# Altium schematic sheet BNC IO.SchDoc
size 297 x 209 mm; CompanyName: Sainsbury Wellcome Centre; Organization: FabLab; Address1: Sainsbury Wellcome Centre; Address2: 25 Howland Street; Address3: London; Address4: W1T 4JG; DocumentNumber: 6; SheetNumber: 2; SheetTotal: 5; swcgroup: FabLab; Org: Sainsbury Wellcome Centre; Add1: 25 Howland Street; Add2: London; Add3: W1T 4JG; WebAddress: www.sainsburywellcome.org; SheetSize: A4; SheetName: BNC IO
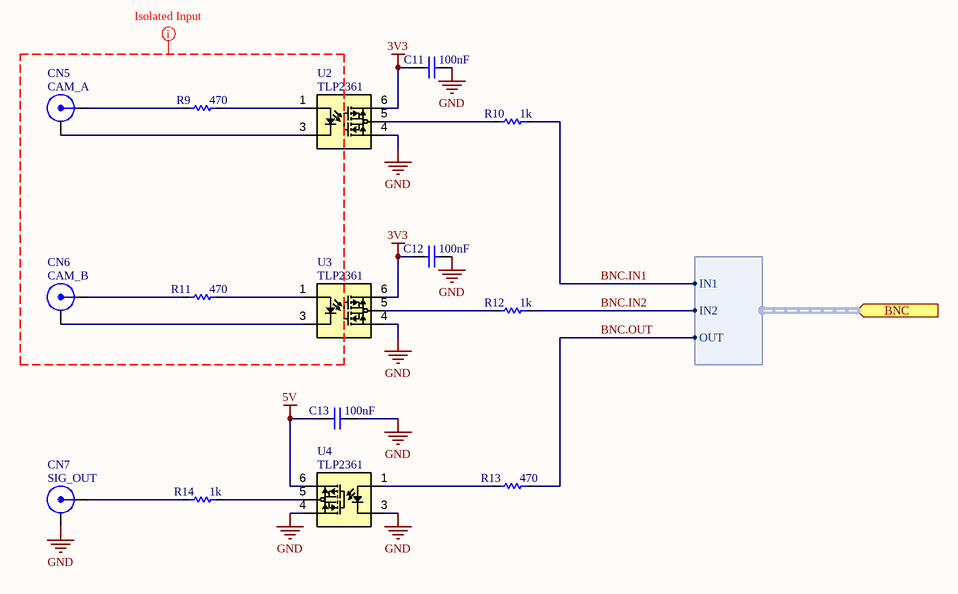
[diagram p0: BNC IO.SchDoc]

## Parts
C11  value 100nF  [CAP_CHIP_0603]  (hidden comment: C0603-100nF-50V)
C12  value 100nF  [CAP_CHIP_0603]  (hidden comment: C0603-100nF-50V)
C13  value 100nF  [CAP_CHIP_0603]  (hidden comment: C0603-100nF-50V)
CN5  CAM_A  [BNC-MOLEX-731000105]
CN6  CAM_B  [BNC-MOLEX-731000105]
CN7  SIG_OUT  [BNC-MOLEX-731000105]
R9  value 470  [RES_CHIP_0603]  (hidden comment: R0603-470R)
R10  value 1k  [RES_CHIP_0603]  (hidden comment: R0603-1K)
R11  value 470  [RES_CHIP_0603]  (hidden comment: R0603-470R)
R12  value 1k  [RES_CHIP_0603]  (hidden comment: R0603-1K)
R13  value 470  [RES_CHIP_0603]  (hidden comment: R0603-470R)
R14  value 1k  [RES_CHIP_0603]  (hidden comment: R0603-1K)
U2  TLP2361  [SO5]
U3  TLP2361  [SO5]
U4  TLP2361  [SO5]

## Ports
BNC (in, harness BNC)

## Harnesses
BNC: IN1, IN2, OUT

## Nets
3V3: C11.2 C12.2 U2.6(VCC) U3.6(VCC)
5V: C13.2 U4.6(VCC)
GND: C11.1 C12.1 C13.1 CN7.2(GND) U2.4(GND) U3.4(GND) U4.3(Cathode) U4.4(GND)
BNC.IN1: R10.2 ; port BNC.IN1
BNC.IN2: R12.2 ; port BNC.IN2
BNC.OUT: R13.2 ; port BNC.OUT
NetCN5_1: CN5.1(SIG) R9.1
NetCN5_2: CN5.2(GND) U2.3(Cathode)
NetCN6_1: CN6.1(SIG) R11.1
NetCN6_2: CN6.2(GND) U3.3(Cathode)
NetCN7_1: CN7.1(SIG) R14.1
NetR9_2: R9.2 U2.1(Anode)
NetR10_1: R10.1 U2.5(Vo)
NetR11_2: R11.2 U3.1(Anode)
NetR12_1: R12.1 U3.5(Vo)
NetR13_1: R13.1 U4.1(Anode)
NetR14_2: R14.2 U4.5(Vo)

## Layout directives
mark named Isolated Input: (no net found under the mark)

## Notes on the sheet
- FILE
- VARIANT
- DATE
- REVISION
- SHEET
- /
- PROJECT
- SIZE

## Library data of the parts
C11-C13 = CMP-611-0027-24: 0603 Multilayer Ceramic Capacitors MLCC; PartNumber: CC0603KRX7R9BB104; Tolerance: 10%; Pick&PlaceFootprint: C0603; Dielectric: X7R; Voltage Rating: 50V; Capacitor Type: Ceramic; RoHS: Yes; Mount: SMD; LCSC Part N.: C14663; Case/Package: 0603
CN5-CN7 = CMP-730-0012-1: 50 Ohms, BNC Right-Angle PCB Jack Receptacle, Nickel Plated Zinc Alloy Body, Low Profile; PartNumber: 731000105; Gender: Female; Impedance: 50Ω; Voltage Rating: 500V; Clock Frequency: 4GHz; Insertion Loss (dB): 0.2dB; LCSC Part N.: C3174924; Mount: Surface Mount; Contact Material: Gold; Contact Plating: Gold; Body Plating: Nickel; Orientation: Right Angle; Termination: Solder
R9 R11 R13 = CMP-633-0020-24: 100mW Thick Film Resistors 75V ±100ppm/℃ ±1% 0603 Chip Resistor; PartNumber: 0603WAF4700T5E; Pick&PlaceFootprint: R0603; Number of Resistors: 1; Voltage Rating: 75V; Power Rating: 100mW; LCSC Part N.: C23179; Case/Package: 0603; Tolerance: 1%; Mount: Surface Mount
R10 R12 R14 = CMP-633-0013-26: 100mW Thick Film Resistors 75V ±100ppm/℃ ±1% 0603 Chip Resistor; PartNumber: 0603WAF1001T5E; Pick&PlaceFootprint: R0603; Number of Resistors: 1; Voltage Rating: 75V; Case/Package: 0603; Tolerance: 1%; Mount: Surface Mount; LCSC Part N.: C21190; Power Rating: 100mW
U2-U4 = CMP-530-0005-1: Logic IC Output Optocoupler, 1-Channel, 1-Element, 3750V Isolation, 20MBps; PartNumber: TLP2361(TPL,E(T; Forward Voltage: 1.5V; Propagation Delay: 80ns; Direction: Unidirectional; Fall Time: 3ns; Forward Current: 10mA; LCSC Part N.: C107626; Output Current per Channel: 10mA